# EAGLE design 5vldo (EAGLE 6.5.0)
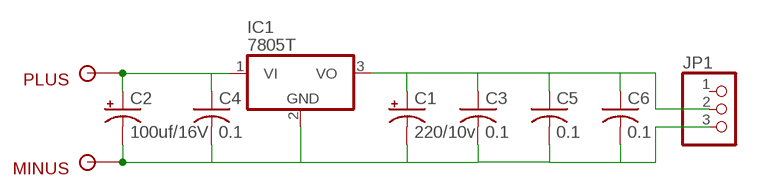
[diagram p0: schematic, sheet 1]

## Parts
C1  220/10v  CPOL-USSMCB  [SMC_B]
C2  100uf/16V  CPOL-USSMCB  [SMC_B]
C3  0.1  C-USC0805  [C0805]
C4  0.1  C-USC0805  [C0805]
C5  0.1  C-USC0805  [C0805]
C6  0.1  C-USC0805  [C0805]
IC1  7805T  [TO220H]
JP1  PINHD-1X3  [1X03]
MINUS  SOLDER_POINTD  [P1-17Y]
PLUS  SOLDER_POINTD  [P1-17Y]

## Nets
N$1: C2.+ C4.1 IC1.1(VI) PLUS.1
N$2: C1.- C2.- C3.2 C4.2 C5.2 C6.2 IC1.2(GND) JP1.3 MINUS.1
N$3: C1.+ C3.1 C5.1 C6.1 IC1.3(VO) JP1.2
Unconnected: JP1.1

## Library data of the parts
C1 C2 = rcl:CPOL-US: POLARIZED CAPACITOR, American symbol
C3-C6 = rcl:C-US: CAPACITOR, American symbol
IC1 = linear:78*: Positive VOLTAGE REGULATOR Source: http://cache.national.com/ds/LM/LM78L05.pdf http://www.fairchildsemi.com/ds/LM/LM7805.pdf
JP1 = 1AA_Stofer:PINHD-1X3: PIN HEADER
MINUS PLUS = 1AA_Stofer:SOLDER_POINT

## Board
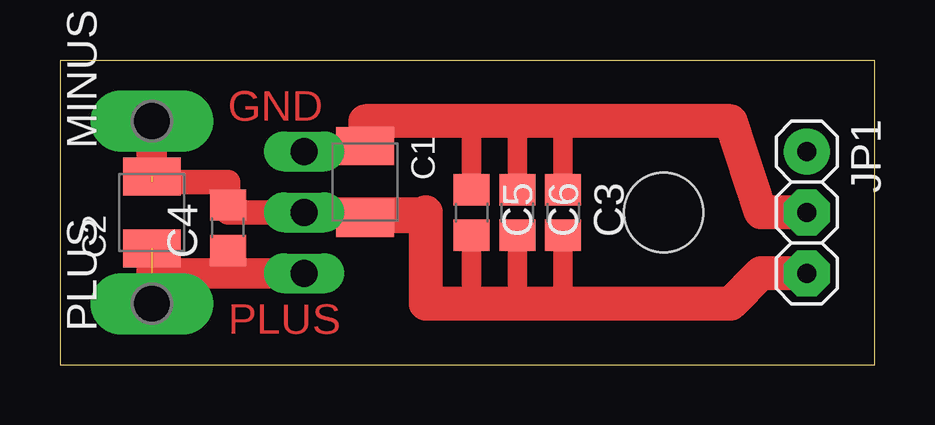
[diagram p1: board, top side]
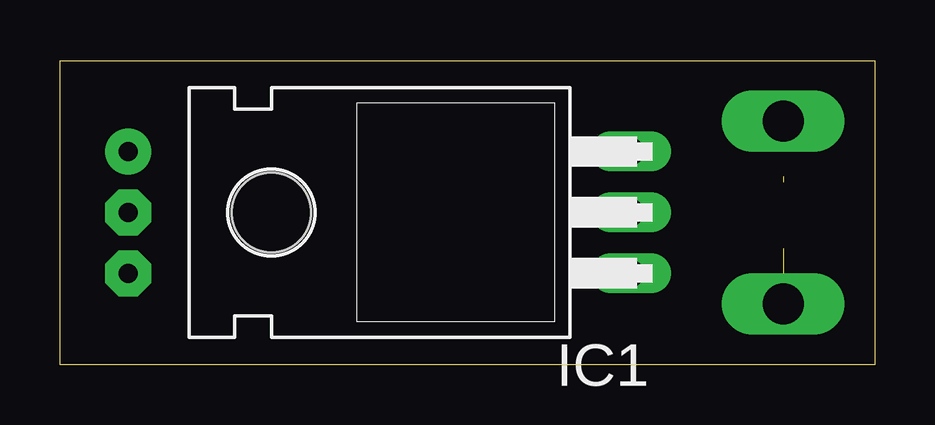
[diagram p2: board, bottom side, seen from below]

Size 33.96 x 12.69 mm. Coordinates in mm from the lower left corner, seen from the top.
Outline: 0,0 33.96,0 33.96,12.69 0,12.69 0,0
Copper layers (1*16): Top 0.035mm / dielectric 1.5mm / Bottom 0.035mm
Design rules "default": minimum track width 10mil, minimum drill 24mil, track to track 8mil, track to pad 8mil, pad to pad 8mil, via to via 8mil, smd to smd 8mil, copper to edge 40mil, drill to drill 8mil, minimum pad ring 10mil, minimum via ring 8mil, stop-mask expansion 4mil, vias tented up to drill 0mil, thermal gap 10mil

### Footprints (pad centres in the part's own frame; a part is rotated, then mirrored left to right if it is on the bottom)
SMC_B = smd 1.6 x 2.4: + -1.5,0; - 1.5,0
C0805 = smd 1.3 x 1.5: 1 -0.95,0; 2 0.95,0
TO220H = drill 1.118 long: 1 -2.54,-10.16; 2 0,-10.16; 3 2.54,-10.16 | hole 3.302: 0,4.826
1X03 = drill 0.8 pad 1.93: 1 -2.54,0 | drill 0.8 pad 1.93 octagon: 2 0,0; 3 2.54,0
P1-17Y = drill 1.702 pad 2.121 long: 1 0,0

### Placement (x,y rotation side)
C1  12.7,7.62 270 top
C2  3.81,6.35 90 top
C3  20.96,6.35 270 top
C4  6.99,5.71 90 top
C5  17.14,6.35 270 top
C6  19.05,6.35 270 top
IC1  20.32,6.35 90 bottom
JP1  31.12,6.35 270 top
MINUS  3.81,10.16 90 top
PLUS  3.81,2.54 90 top

### Tracks (layer width: path | path; a pad name or v marks a point on that pad's centre or on a via)
N$1  (1 unrouted)
  Top 0.813: C4.1 6.99,3.81
  Top 1.27: IC1.1 6.99,3.81 3.81,3.81 | PLUS.1 C2.+
N$2  (1 unrouted)
  Top 0.813: 12.7,6.35 C1.- | C5.2 17.14,2.54 | C6.2 19.05,2.54 | C3.2 20.96,2.54 | 6.99,6.35 C4.2
  Top 1.016: IC1.2 6.99,6.35 | C4.2 6.99,7.62 3.81,7.62
  Top 1.27: IC1.2 15.24,6.35 15.24,6.12 C1.- | MINUS.1 C2.-
  Top 1.422: JP1.3 29.21,3.81 27.94,2.54 20.96,2.54 19.05,2.54 17.14,2.54 15.24,2.54 15.24,6.35
N$3
  Top 0.813: C1.+ 10.16,9.12 IC1.3 | C3.1 20.96,10.16 | C6.1 19.05,10.16 | C5.1 17.14,10.16
  Top 1.422: JP1.2 29.21,6.35 27.94,10.16 20.96,10.16 19.05,10.16 17.14,10.16 12.7,10.16 C1.+

### Text on the board
Top: GND | PLUS